# Altium schematic sheet UI.SchDoc: User Interface
size A; Author: Craig Hesling; DrawnBy: Craig Hesling; Revision: 1
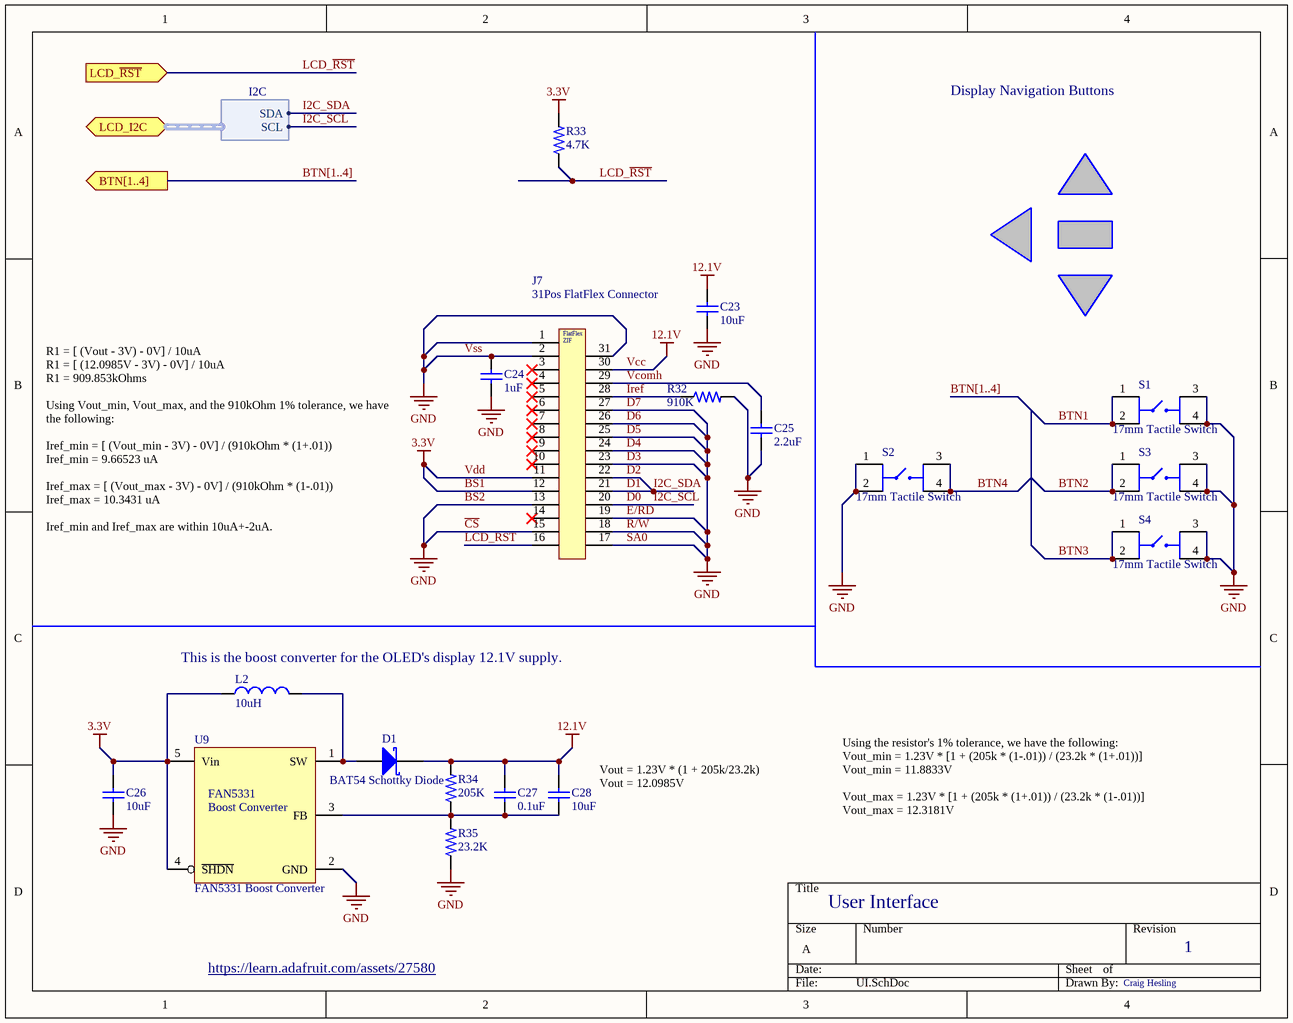
[diagram p0: UI.SchDoc]

## Parts
C23  10uF  [CAPC3216X18L - CAP1206 1.8MM TALL]
C24  1uF  [CAPC1608X09L - CAP0603]
C25  2.2uF  [CAPC1608X09L - CAP0603]
C26  10uF  [CAPC2013X14L - CAP0805 1.45mm Tall]
C27  0.1uF  [CAPC1608X09L - CAP0603]
C28  10uF  [CAPC3216X18L - CAP1206 1.8MM TALL]
D1  BAT54 Schottky Diode  [SOT95P240X120-3L - ON Semi]
J7  31Pos FlatFlex Connector  [31 Position Flat Flex ZIF Connector]
L2  10uH  [INDP4949X20L]
R32  910K  [RESC1608X06L - RES0603]
R33  4.7K  [RESC1608X06L - RES0603]
R34  205K  [RESC1608X06L - RES0603]
R35  23.2K  [RESC1608X06L - RES0603]
S1  17mm Tactile Switch  [TactileSwitchTE17mm]
S2  17mm Tactile Switch  [TactileSwitchTE17mm]
S3  17mm Tactile Switch  [TactileSwitchTE17mm]
S4  17mm Tactile Switch  [TactileSwitchTE17mm]
U9  FAN5331 Boost Converter  [SOT95P280X145-5L - ON Semi]

## Ports
BTN[1..4] (out), LCD_I2C (harness I2C), LCD_~{RST} (in)

## Harnesses
I2C: SDA, SCL

## Nets
BS1: C26.2 J7.11 J7.12 L2.1 R33.2 U9.4(~{SHDN}) U9.5(Vin)  [also labelled 3.3V, Vdd]
BS2: C23.1 C24.1 C24.2 C25.1 C26.1 J7.1 J7.2 J7.13 J7.15 J7.17 J7.18 J7.19 J7.23 J7.24 J7.25 J7.26 J7.27 J7.31 R32.2 R35.1 S1.3 S1.4 S2.1 S2.2 S3.3 S3.4 S4.3 S4.4 U9.2(GND)  [also labelled ~{CS}, D3, D4, D5, D6, D7, ~{E/RD}, GND, ~{R/W}, SA0, Vss]
Vcc: C23.2 C27.2 C28.2 D1.3(K) J7.30 R34.2  [also labelled 12.1V]
BTN1: S1.1 S1.2
BTN2: S3.1 S3.2
BTN3: S4.1 S4.2
BTN4: S2.3 S2.4
D0: J7.20 ; port LCD_I2C.SCL  [also labelled I2C_SCL]
D1: J7.21 J7.22 ; port LCD_I2C.SDA  [also labelled D2, I2C_SDA]
Iref: J7.28 R32.1
LCD_~{RST}: J7.16 R33.1 ; port LCD_~{RST}
Vcomh: C25.2 J7.29
NetC27_1: C27.1 C28.1 R34.1 R35.2 U9.3(FB)
NetD1_1: D1.1(A) L2.2 U9.1(SW)

Not connected (* = marked no-connect by the designer): J7 3* 4* 5* 6* 7* 8* 9* 10* 14*

## Buses and harness runs
bus BTN[1..4]
bus BTN[1..4] = port BTN[1..4]

## Notes on the sheet
- Display Navigation Buttons
- R1 = [ (Vout - 3V) - 0V] / 10uA
  R1 = [ (12.0985V - 3V) - 0V] / 10uA
  R1 = 909.853kOhms
  Using Vout_min, Vout_max, and the 910kOhm 1% tolerance, we have the following:
  Iref_min = [ (Vout_min - 3V) - 0V] / (910kOhm * (1+.01))
  Iref_min = 9.66523 uA
  Iref_max = [ (Vout_max - 3V) - 0V] / (910kOhm * (1-.01))
  Iref_max = 10.3431 uA
  Iref_min and Iref_max are within 10uA+-2uA.
- (near L2) This is the boost converter for the OLED's display 12.1V supply.
- (near C28) Vout = 1.23V * (1 + 205k/23.2k)
  Vout = 12.0985V
- Using the resistor's 1% tolerance, we have the following:
  Vout_min = 1.23V * [1 + (205k * (1-.01)) / (23.2k * (1+.01))]
  Vout_min = 11.8833V
  Vout_max = 1.23V * [1 + (205k * (1+.01)) / (23.2k * (1-.01))]
  Vout_max = 12.3181V
- https://learn.adafruit.com/assets/27580
- (in symbol 31 Position Flat Flex ZIF Connector) FlatFlex; ZIF
- (in symbol FAN5331) Boost Converter

## Library data of the parts
C23 C28 = CAP1206 10uF 10% 16V X5R: SMT 1206 Ceramic Capacitor; TempCoeff: X5R; Tolerance: 10%; Voltage: 16V; Value: 10uF; Supplier 1: Digi-Key; Supplier 2: Digi-Key; Supplier Part Number 1: 1276-1137-1-ND; Supplier Part Number 2: 490-10526-1-ND
C24 = CAP0603 1uF 5% 10V X7R: SMT 0603 Ceramic Capacitor; TempCoeff: X7R; Tolerance: 5%; Voltage: 10V; Value: 1uF; Supplier 1: Digi-Key; Supplier 2: Mouser; Supplier 3: Digi-Key; Supplier Part Number 1: 478-10074-1-ND; Supplier Part Number 2: 581-0603ZC105JAT2A; Supplier Part Number 3: 311-3484-1-ND
C25 = CAP0603 2.2uF 10% 6.3V X7R: SMT 0603 Ceramic Capacitor; TempCoeff: X7R; Tolerance: 10%; Voltage: 6.3V; Value: 2.2uF; Supplier 1: Digi-Key; Supplier 2: Digi-Key; Supplier Part Number 1: 1276-2017-1-ND; Supplier Part Number 2: 311-1795-1-ND
C26 = CAP0805 10uF 10% 6.3V X5R: SMT 0805 Ceramic Capacitor; TempCoeff: X5R; Tolerance: 10%; Voltage: 6.3V; Value: 10uF; Supplier 1: Digi-Key; Supplier Part Number 1: 1276-6457-1-ND
C27 = CAP0603 0.1uF 10% 25V X7R: SMT 0603 Ceramic Capacitor; TempCoeff: X7R; Tolerance: 10%; Voltage: 25V; Value: 0.1uF; Supplier 1: Digi-Key; Supplier 2: Digi-Key; Supplier Part Number 1: 311-1341-1-ND; Supplier Part Number 2: 490-1524-1-ND
D1 = BAT54: ON Semi BAT54 800mV Schottky Diode; Vr: 30V; Vf: 800mV; Supplier 1: Digi-Key; Supplier 2: Mouser; Supplier Part Number 1: BAT54SLT1GOSCT-ND; Supplier Part Number 2: 512-BAT54
J7 = 31 Position Flat Flex ZIF Connector: TE 3-1734839-1 31 Position Flat Flex ZIF Connector; Positions: 31; Supplier 1: Digi-Key; Supplier Part Number 1: A101346CT-ND
L2 = INDWW 10uH 1.45A 20% 144mOhm 24MHz: SMT Wire Wound Inductor; Tolerance: 20%; Current Rating: 1.45A; Self Resonant: 24MHz; Value: 10uH; DC Resistance: 144mOhm; Supplier 1: Digi-Key; Supplier 2: Mouser; Supplier Part Number 1: 587-2409-1-ND; Supplier Part Number 2: 963-NRS5020T100MMGJ
R32 = RES0603 910K 1% 1/10W: SMT 0603 Ceramic Resistor; Power: 1/10W; Tolerance: 1%; Value: 910K; Supplier 1: Digi-Key; Supplier 2: Digi-Key; Supplier 3: Digi-Key; Supplier Part Number 1: 311-910KHRCT-ND; Supplier Part Number 2: P910KHCT-ND; Supplier Part Number 3: RMCF0603FT910KCT-ND
R33 = RES0603 4.7K 1% 1/10W: SMT 0603 Ceramic Resistor; Power: 1/10W; Tolerance: 1%; Value: 4.7K; Supplier 1: Digi-Key; Supplier 2: Digi-Key; Supplier 3: Digi-Key; Supplier Part Number 1: 311-4.70KHRCT-ND; Supplier Part Number 2: P4.70KHCT-ND; Supplier Part Number 3: RMCF0603FT4K70CT-ND
R34 = RES0603 205K 1% 1/10W: SMT 0603 Ceramic Resistor; Power: 1/10W; Tolerance: 1%; Value: 205K; Supplier 1: Digi-Key; Supplier 2: Digi-Key; Supplier 3: Digi-Key; Supplier Part Number 1: 311-205KHRCT-ND; Supplier Part Number 2: P205KHCT-ND; Supplier Part Number 3: 541-205KHCT-ND
R35 = RES0603 23.2K 1% 1/10W: SMT 0603 Ceramic Resistor; Power: 1/10W; Tolerance: 1%; Value: 23.2K; Supplier 1: Digi-Key; Supplier 2: Digi-Key; Supplier 3: Digi-Key; Supplier Part Number 1: 311-23.2KHRCT-ND; Supplier Part Number 2: 541-23.2KHCT-ND; Supplier Part Number 3: RMCF0603FG23K2CT-ND
S1-S4 = TE 3-1825910-1 17mm Tactile Switch: Supplier 1: Digi-Key; Supplier Part Number 1: 450-1643-ND
U9 = FAN5331: ON Semi FAN5531 Boost Converter; Supplier 1: Digi-Key; Supplier 2: Mouser; Supplier Part Number 1: FAN5331SXCT-ND; Supplier Part Number 2: 512-FAN5331SX